# Altium project Buck_Converter_2024.PrjPcb
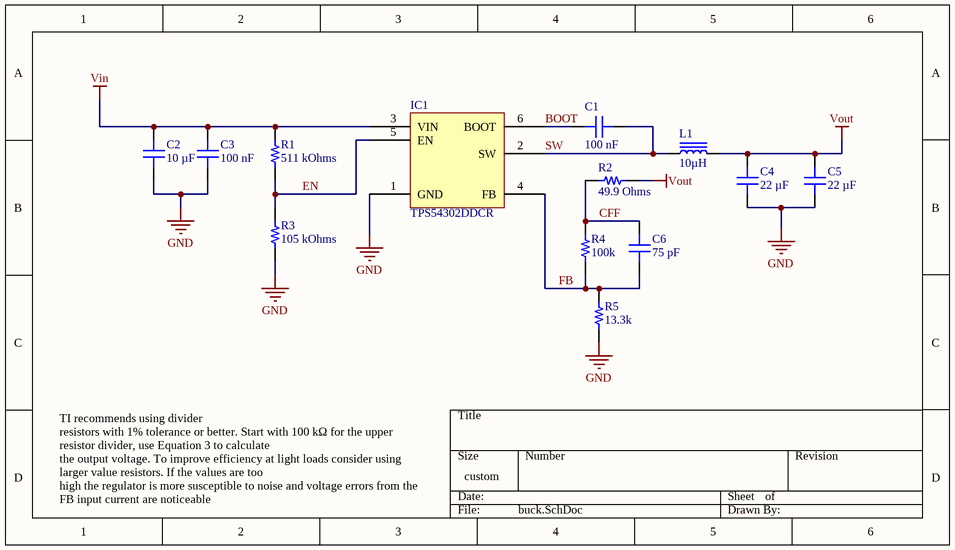
[diagram p0: buck.SchDoc]
1 sheet, 13 parts. Net scope: global (net labels, ports and power ports of the same name join across sheets).
Board file: buck.PcbDoc

## Sheet buck.SchDoc
size 177 x 101 mm; SheetNumber: 1; SheetTotal: 1

### Parts
C1  100 nF  [CAP 0603_1608]
C2  10 µF  [CAP 0805_2012]
C3  100 nF  [CAP 0603_1608]
C4  22 µF  [CAP 0805_2012]
C5  22 µF  [CAP 0805_2012]
C6  75 pF  [CAP 0603_1608]
IC1  TPS54302DDCR  [TI SOT-23-6 DDC]
L1  10µH  [IND 1008_2520]
R1  511 kOhms  [RES 0805_2012]
R2  49.9 Ohms  [RES 0805_2012]
R3  105 kOhms  [RES 0805_2012]
R4  100k  [RES 0805_2012]
R5  13.3k  [RES 0805_2012]

### Nets
GND: C2.1 C3.1 C4.1 C5.1 IC1.1(GND) R3.2 R5.2
Vin: C2.2 C3.2 IC1.3(VIN) R1.2
Vout: C4.2 C5.2 L1.2 R2.1
BOOT: C1.1 IC1.6(BOOT)
CFF: C6.2 R2.2 R4.1
EN: IC1.5(EN) R1.1 R3.1
FB: C6.1 IC1.4(FB) R4.2 R5.1
SW: C1.2 IC1.2(SW) L1.1

### Notes on the sheet
- TI recommends using divider
  resistors with 1% tolerance or better. Start with 100 kΩ for the upper resistor divider, use Equation 3 to calculate
  the output voltage. To improve efficiency at light loads consider using larger value resistors. If the values are too
  high the regulator is more susceptible to noise and voltage errors from the FB input current are noticeable

### Library data of the parts
C1 C3 = C0603C104J4RECAUTO: CAP CER 0603 0.1UF 16V X7R 5%; manufacturer: KEMET; Capacitance: 0.1 µF; Part Number: C0603C104J4RECAUTO; Value: 100 nF; Applications: Automotive, ESD Protection; componentlink1description: Datasheet; componentlink1url: https://connect.kemet.com:7667/gateway/IntelliData-ComponentDocumentation/1.0/download/datasheet/C0603C104J4RECAUTO; componentlink2description: DigiKey Link; componentlink2url: https://www.digikey.com/en/products/detail/kemet/C0603C104J4RECAUTO/8646524; Device Package: 0603 (1608 Metric); lastupdated: 2/7/2024 8:09:29 PM; Lifecycle Status: Active; Minimum Order: 1; Mounting Type: Surface Mount, MLCC; Operating Temperature: -55°C ~ 125°C; Package / Case: 0603 (1608 Metric); packaging: TapeAndReel; partid: 46901; Part Status: Active; price: 0.02; Ratings: AEC-Q200; series: ESD SMD Auto X7R; Size / Dimension: 0.063" L x 0.031" W (1.60mm x 0.80mm); Supplier 1: DigiKey; Supplier Part Number 1: 399-C0603C104J4RECAUTOCT-ND; Temperature Coefficient: X7R; Thickness (Max): 0.034" (0.87mm); Tolerance: ±5%; Voltage - Rated: 16V
C2 = C2012X7R1A106K125AE: CAP CER 10UF 10V X7R 0805; manufacturer: TDK Corporation; Tolerance: ±10%; Part Number: C2012X7R1A106K125AE; Value: 10 µF; Applications: Boardflex Sensitive; Capacitance: 10 µF; componentlink1description: Datasheet; componentlink1url: https://product.tdk.com/info/en/catalog/datasheets/mlcc_commercial_soft_en.pdf?ref_disty=digikey; componentlink2description: DigiKey Link; componentlink2url: https://www.digikey.com/en/products/detail/tdk-corporation/C2012X7R1A106K125AE/5809181; Device Package: 0805 (2012 Metric); Features: Soft Termination; lastupdated: 2/7/2024 8:15:44 PM; Lifecycle Status: Active; Minimum Order: 1; Mounting Type: Surface Mount, MLCC; Operating Temperature: -55°C ~ 125°C; Package / Case: 0805 (2012 Metric); packaging: TapeAndReel; partid: 3036; Part Status: Active; price: 0.07; series: C; Size / Dimension: 0.079" L x 0.049" W (2.00mm x 1.25mm); Supplier 1: DigiKey; Supplier Part Number 1: 445-173616-1-ND; Temperature Coefficient: X7R; Thickness (Max): 0.059" (1.50mm); Voltage - Rated: 10V
C4 C5 = CL21A226KOQNNNG: CAP CER 22UF 16V X5R 0805; manufacturer: Samsung Electro-Mechanics; Tolerance: ±10%; Part Number: CL21A226KOQNNNG; Value: 22 µF; Applications: General Purpose; Capacitance: 22 µF; componentlink1description: Datasheet; componentlink1url: //media.digikey.com/pdf/Data%20Sheets/Samsung%20PDFs/CL21A226KOQNNNG_Spec.pdf; componentlink2description: DigiKey Link; componentlink2url: https://www.digikey.com/en/products/detail/samsung-electro-mechanics/CL21A226KOQNNNG/3894433; Device Package: 0805 (2012 Metric); lastupdated: 2/7/2024 8:15:44 PM; Lifecycle Status: Active; Minimum Order: 1; Mounting Type: Surface Mount, MLCC; Operating Temperature: -55°C ~ 85°C; Package / Case: 0805 (2012 Metric); packaging: TapeAndReel; partid: 3000; Part Status: Active; price: 0.06; series: CL; Size / Dimension: 0.079" L x 0.049" W (2.00mm x 1.25mm); Supplier 1: DigiKey; Supplier Part Number 1: 1276-7092-1-ND; Temperature Coefficient: X5R; Thickness (Max): 0.055" (1.40mm); Voltage - Rated: 16V
C6 = C0603C750K5RACAUTO: CAP CER 75PF 50V X7R 0603; manufacturer: KEMET; Tolerance: ±10%; Part Number: C0603C750K5RACAUTO; Value: 75 pF; Applications: Automotive, Bypass, Decoupling; Capacitance: 75 pF; componentlink1description: Datasheet; componentlink1url: https://connect.kemet.com:7667/gateway/IntelliData-ComponentDocumentation/1.0/download/datasheet/C0603C750K5RACAUTO; componentlink2description: DigiKey Link; componentlink2url: https://www.digikey.com/en/products/detail/kemet/C0603C750K5RACAUTO/16798108; Device Package: 0603 (1608 Metric); lastupdated: 2/7/2024 8:09:21 PM; Lifecycle Status: Active; Minimum Order: 1; Mounting Type: Surface Mount, MLCC; Operating Temperature: -55°C ~ 125°C; Package / Case: 0603 (1608 Metric); packaging: TapeAndReel; partid: 48229; Part Status: Active; price: 0.04; Ratings: AEC-Q200; series: SMD Auto X7R; Size / Dimension: 0.063" L x 0.031" W (1.60mm x 0.80mm); Supplier 1: DigiKey; Supplier Part Number 1: 399-C0603C750K5RACAUTOCT-ND; Temperature Coefficient: X7R; Thickness (Max): 0.034" (0.87mm); Voltage - Rated: 50V
IC1 = TPS54302DDCT: IC REG BUCK ADJ 3A TSOT23-6; Manufacturer: Texas Instruments; Frequency - Switching: 400kHz; Function: Step-Down; Number of Outputs: 1; Output Configuration: Positive; Output Type: Adjustable; Synchronous Rectifier: Yes; Voltage - Input (Max): 28V; Voltage - Input (Min): 4.5V; Voltage - Output (Min/Fixed): 0.596V; Part Number: TPS54302DDCT; ComponentLink1Description: Datasheet; ComponentLink1URL: http://www.ti.com/general/docs/suppproductinfo.tsp?distId=10&gotoUrl=http%3A%2F%2Fwww.ti.com%2Flit%2Fgpn%2Ftps54302; ComponentLink2Description: DigiKey Link; ComponentLink2URL: http://digikey.com/product-detail/en/texas-instruments/TPS54302DDCT/296-44542-1-ND/6128450; Current - Output: 3A; Device Package: SOT-23-6 Thin, TSOT-23-6; LastUpdated: 2/4/2020 2:31:43 PM; Lifecycle Status: Active; Minimum Order: 1; Mounting Type: Surface Mount; Operating Temperature: -40°C ~ 125°C (TJ); Package / Case: SOT-23-6 Thin, TSOT-23-6; Packaging: TapeAndReel; Part Status: Active; Price: 1.06; Series: -; Supplier 1: DigiKey; Supplier Part Number 1: 296-44542-1-ND; Supplier Device Package: TSOT-23-6; Topology: Buck; Voltage - Output (Max): 28V
L1 = 1269AS-H-100N=P2: FIXED IND 10UH 1A 689 MOHM SMD; Manufacturer: Murata Electronics; DC Resistance (DCR): 689mOhm Max; Inductance Frequency - Test: 1MHz; Material - Core: Iron Powder; Shielding: Shielded; Tolerance: ±30%; Type: Wirewound; Part Number: 1269AS-H-100N=P2; ComponentLink1Description: Datasheet; ComponentLink1URL: https://search.murata.co.jp/Ceramy/image/img/P02/J(E)TE243A-0004_DFE252010C_reference.pdf; ComponentLink2Description: DigiKey Link; ComponentLink2URL: http://digikey.com/product-detail/en/murata-electronics/1269AS-H-100N=P2/490-10572-1-ND/5272028; Current Rating (Amps): 1A; Device Package: 1008 (2520 Metric); Height - Seated (Max): 0.039" (1.00mm); Inductance: 10µH; LastUpdated: 9/2/2020 1:29:15 AM; Lifecycle Status: Active; Minimum Order: 1; Mounting Type: Surface Mount; Operating Temperature: -40°C ~ 85°C; Package / Case: 1008 (2520 Metric); Packaging: TapeAndReel; PartId: 3455; Part Status: Active; Price: 0.14; Series: DFE252010C; Size / Dimension: 0.098" L x 0.079" W (2.50mm x 2.00mm); Supplier 1: DigiKey; Supplier Part Number 1: 490-10572-1-ND; Supplier Device Package: 1008 (2520 Metric); Value: 10µH
R1 = ERJ-PB6D5113V: RES SMD 511K OHM 0.5% 1/4W 0805; Manufacturer: Panasonic Electronic Components; Power (Watts): 0.25W, 1/4W; Temperature Coefficient: ±50ppm/°C; Part Number: ERJ-PB6D5113V; Value: 511 kOhms; ComponentLink1Description: Datasheet; ComponentLink1URL: https://industrial.panasonic.com/cdbs/www-data/pdf/RDM0000/AOA0000C328.pdf; ComponentLink2Description: DigiKey Link; ComponentLink2URL: https://www.digikey.com/en/products/detail/panasonic-electronic-components/ERJ-PB6D5113V/6214111; Composition: Thick Film; Device Package: 0805 (2012 Metric); Features: Automotive AEC-Q200, Pulse Withstanding; Height - Seated (Max): 0.028" (0.70mm); LastUpdated: 2/7/2024 9:01:00 PM; Lifecycle Status: Active; Minimum Order: 1; Number of Terminations: 2; Operating Temperature: -55°C ~ 155°C; Package / Case: 0805 (2012 Metric); Packaging: TapeAndReel; PartId: 30962; Part Status: Active; Price: 0.02; Ratings: AEC-Q200; Resistance: 511 kOhms; Series: ERJ-PB6; Size / Dimension: 0.079" L x 0.049" W (2.00mm x 1.25mm); Supplier 1: DigiKey; Supplier Part Number 1: P21328CT-ND; Supplier Device Package: 0805; Tolerance: ±0.5%
R2-R5 = ERJ-PB6D5113V: RES SMD 511K OHM 0.5% 1/4W 0805; Manufacturer: Panasonic Electronic Components; Power (Watts): 0.25W, 1/4W; Resistance: 511 kOhms; Temperature Coefficient: ±50ppm/°C; Part Number: ERJ-PB6D5113V; ComponentLink1Description: Datasheet; ComponentLink1URL: https://industrial.panasonic.com/cdbs/www-data/pdf/RDM0000/AOA0000C328.pdf; ComponentLink2Description: DigiKey Link; ComponentLink2URL: https://www.digikey.com/en/products/detail/panasonic-electronic-components/ERJ-PB6D5113V/6214111; Composition: Thick Film; Device Package: 0805 (2012 Metric); Features: Automotive AEC-Q200, Pulse Withstanding; Height - Seated (Max): 0.028" (0.70mm); LastUpdated: 2/7/2024 9:01:00 PM; Lifecycle Status: Active; Minimum Order: 1; Number of Terminations: 2; Operating Temperature: -55°C ~ 155°C; Package / Case: 0805 (2012 Metric); Packaging: TapeAndReel; PartId: 30962; Part Status: Active; Price: 0.02; Ratings: AEC-Q200; Series: ERJ-PB6; Size / Dimension: 0.079" L x 0.049" W (2.00mm x 1.25mm); Supplier 1: DigiKey; Supplier Part Number 1: P21328CT-ND; Supplier Device Package: 0805; Tolerance: ±0.5%
  R2: Value: 49.9 Ohms
  R3: Value: 105 kOhms
  R4: Value: 100k
  R5: Value: 13.3k